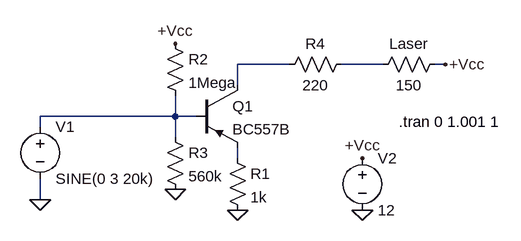
[diagram p0: schematic laser_driver_new.asc]
laser_driver_new.asc, the LTspice schematic file:
Version 4
SHEET 1 1032 680
WIRE 272 32 192 32
WIRE 416 32 352 32
WIRE 512 32 496 32
WIRE 192 64 192 32
WIRE 96 112 96 80
WIRE 96 112 -112 112
WIRE 128 112 96 112
WIRE -112 128 -112 112
WIRE 96 144 96 112
WIRE 192 176 192 160
WIRE -112 240 -112 208
FLAG 192 256 0
FLAG 96 224 0
FLAG 96 0 +Vcc
FLAG -112 240 0
FLAG 512 32 +Vcc
FLAG 384 256 0
FLAG 384 176 +Vcc
SYMBOL res 176 160 R0
SYMATTR InstName R1
SYMATTR Value 1k
SYMBOL res 80 -16 R0
SYMATTR InstName R2
SYMATTR Value 1Mega
SYMBOL res 80 128 R0
SYMATTR InstName R3
SYMATTR Value 560k
SYMBOL voltage -112 112 R0
WINDOW 123 0 0 Left 0
WINDOW 39 0 0 Left 0
SYMATTR InstName V1
SYMATTR Value SINE(0 3 20k)
SYMBOL res 368 16 R90
WINDOW 0 0 56 VBottom 2
WINDOW 3 32 56 VTop 2
SYMATTR InstName R4
SYMATTR Value 220
SYMBOL res 512 16 R90
WINDOW 0 0 56 VBottom 2
WINDOW 3 32 56 VTop 2
SYMATTR InstName Laser
SYMATTR Value 150
SYMBOL voltage 384 160 R0
WINDOW 123 0 0 Left 0
WINDOW 39 0 0 Left 0
SYMATTR InstName V2
SYMATTR Value 12
SYMBOL pnp 128 64 R0
SYMATTR InstName Q1
SYMATTR Value BC557B
TEXT 440 120 Left 2 !.tran 0 1.001 1

The netlist it stands for:
* laser_driver_new.asc
R1 N004 0 1k
R2 +Vcc N003 1Mega
R3 N003 0 560k
V1 N003 0 SINE(0 3 20k)
R4 N002 N001 220
R§Laser +Vcc N002 150
V2 +Vcc 0 12
Q1 N001 N003 N004 0 BC557B
.model NPN NPN
.model PNP PNP
.lib standard.bjt
.tran 0 1.001 1
.backanno
.end